# Altium schematic sheet main.SchDoc
size A4; SheetNumber: 1; SheetTotal: 8
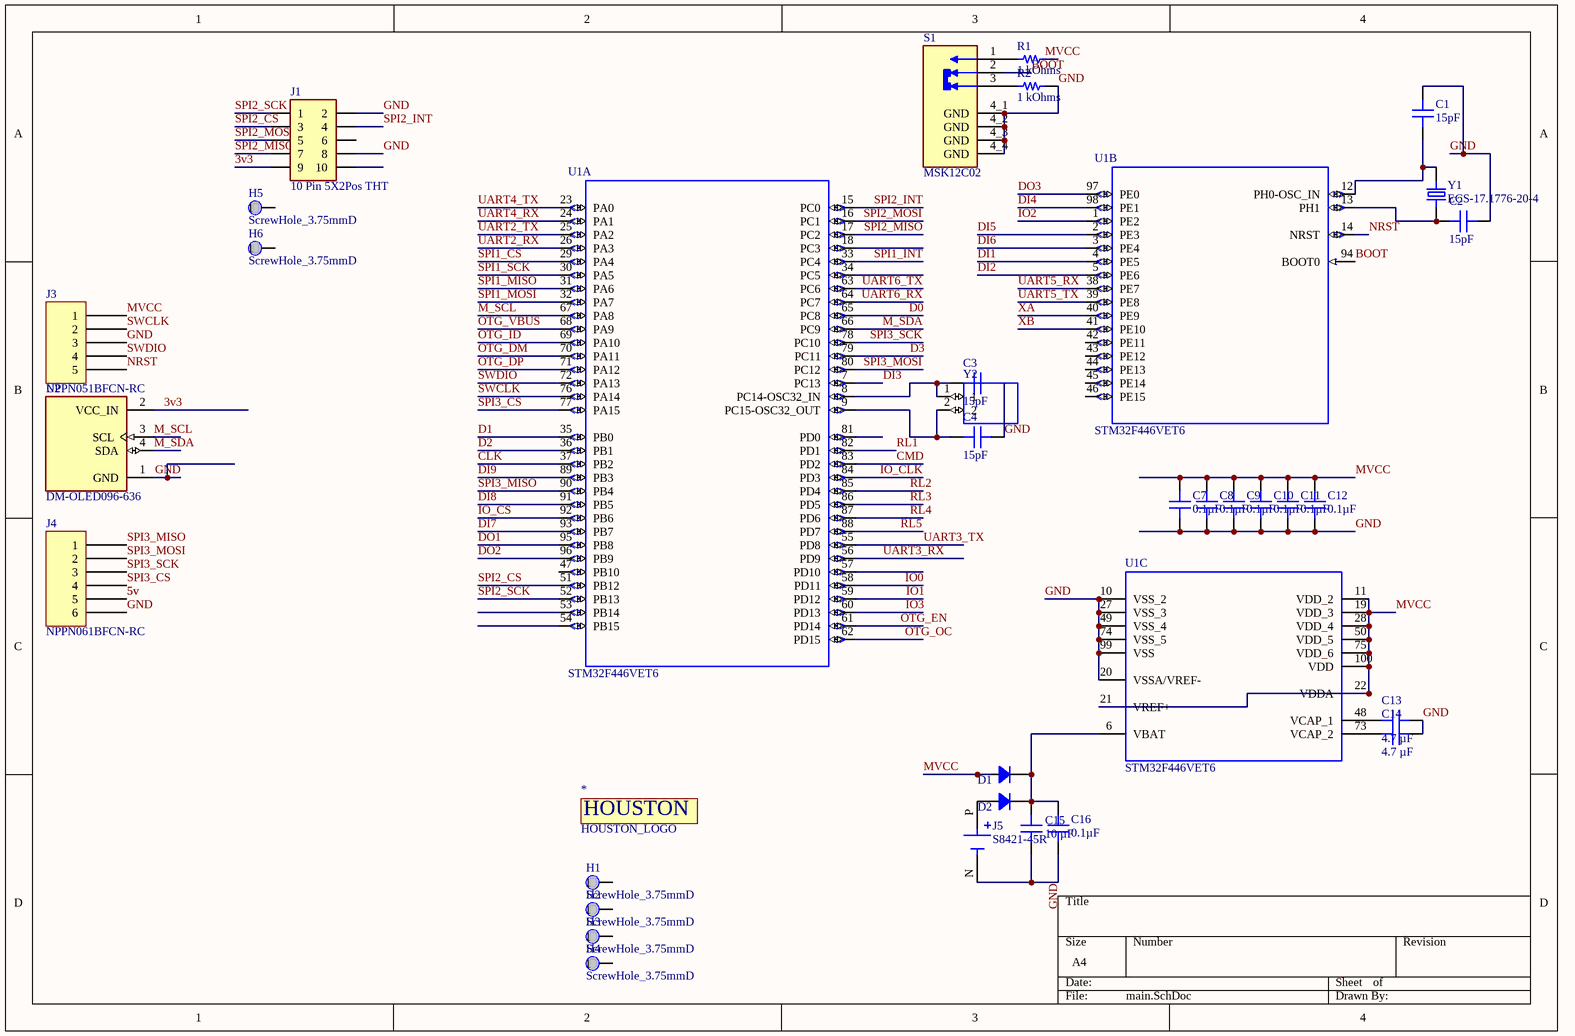
[diagram p0: main.SchDoc]

## Parts
*  HOUSTON_LOGO  [HOUSTON_LOGO]
C1  15pF  [CAP 0805_2012]
C2  15pF  [CAP 0805_2012]
C3  15pF  [CAP 0805_2012]
C4  15pF  [CAP 0805_2012]
C7  Capacitance: 0.1µF  [CAP 0805_2012]  (hidden comment: 1µF)
C8  Capacitance: 0.1µF  [CAP 0805_2012]  (hidden comment: 1µF)
C9  Capacitance: 0.1µF  [CAP 0805_2012]  (hidden comment: 1µF)
C10  Capacitance: 0.1µF  [CAP 0805_2012]  (hidden comment: 1µF)
C11  Capacitance: 0.1µF  [CAP 0805_2012]  (hidden comment: 1µF)
C12  Capacitance: 0.1µF  [CAP 0805_2012]  (hidden comment: 1µF)
C13  4.7 µF  [CAP 0805_2012]
C14  4.7 µF  [CAP 0805_2012]
C15  10 µF  [CAP 1206_3216 - 0.8MM]
C16  Capacitance: 0.1µF  [CAP 0805_2012]  (hidden comment: 1µF)
D1  CGRA4007-G  [DO214AC SMA]  (value not drawn)
D2  CGRA4007-G  [DO214AC SMA]  (value not drawn)
H1  ScrewHole_3.75mmD  [ScrewHole_3.75mmD - duplicate]
H2  ScrewHole_3.75mmD  [ScrewHole_3.75mmD - duplicate]
H3  ScrewHole_3.75mmD  [ScrewHole_3.75mmD - duplicate]
H4  ScrewHole_3.75mmD  [ScrewHole_3.75mmD - duplicate]
H5  ScrewHole_3.75mmD  [ScrewHole_3.75mmD - duplicate]
H6  ScrewHole_3.75mmD  [ScrewHole_3.75mmD - duplicate]
J1  10 Pin 5X2Pos THT  [10 Pin 5X2Pos THT]
J3  NPPN051BFCN-RC  [SULLINS NPPN051BFCN]
J4  NPPN061BFCN-RC  [SULLINS NPPN061BFCN]
J5  S8421-45R  [HARWIN_S8421-45R]
R1  1 kOhms  [RES 0805_2012]
R2  1 kOhms  [RES 0805_2012]
S1  MSK12C02  [SW_MSK12C02]
U1  STM32F446VET6  [LQFP100-14X14MM]  (parts A,B,C of 3)
U2  DM-OLED096-636  [MODULE_DM-OLED096-636]
Y1  ECS-17.1776-20-4  [XTAL_ECS-160-20-4X]
Y2  CFS-20632768EZBB  [CFS20632768EZBB]  (value not drawn)

## Nets
3v3: J1.9 U2.2(VCC_IN)
5v: J4.5
BOOT: S1.2 U1.94(BOOT0)
CLK: U1.37(PB2)
CMD: U1.83(PD2)
D0: U1.65(PC8)
D1: U1.35(PB0)
D2: U1.36(PB1)
D3: U1.79(PC11)
DI1: U1.4(PE5)
DI2: U1.5(PE6)
DI3: U1.7(PC13)
DI4: U1.98(PE1)
DI5: U1.2(PE3)
DI6: U1.3(PE4)
DI7: U1.93(PB7)
DI8: U1.91(PB5)
DI9: U1.89(PB3)
DO1: U1.95(PB8)
DO2: U1.96(PB9)
DO3: U1.97(PE0)
GND: C1.2 C2.2 C3.2 C4.2 C7.1 C8.1 C9.1 C10.1 C11.1 C12.1 C13.2 C14.2 C15.1 C16.1 J1.2 J1.8 J3.3 J4.6 J5.N(NEG) R2.2 S1.4_1(GND) S1.4_2(GND) S1.4_3(GND) S1.4_4(GND) U1.10(VSS_2) U1.20(VSSA/VREF-) U1.27(VSS_3) U1.49(VSS_4) U1.74(VSS_5) U1.99(VSS) U2.1(GND)
IO0: U1.58(PD11)
IO1: U1.59(PD12)
IO2: U1.1(PE2)
IO3: U1.60(PD13)
IO_CLK: U1.84(PD3)
IO_CS: U1.92(PB6)
M_SCL: U1.67(PA8) U2.3(SCL)
M_SDA: U1.66(PC9) U2.4(SDA)
MVCC: C7.2 C8.2 C9.2 C10.2 C11.2 C12.2 D1.1 J3.1 R1.1 U1.11(VDD_2) U1.19(VDD_3) U1.21(VREF+) U1.22(VDDA) U1.28(VDD_4) U1.50(VDD_5) U1.75(VDD_6) U1.100(VDD)
NRST: J3.5 U1.14(NRST)
OTG_DM: U1.70(PA11)
OTG_DP: U1.71(PA12)
OTG_EN: U1.61(PD14)
OTG_ID: U1.69(PA10)
OTG_OC: U1.62(PD15)
OTG_VBUS: U1.68(PA9)
RL1: U1.82(PD1)
RL2: U1.85(PD4)
RL3: U1.86(PD5)
RL4: U1.87(PD6)
RL5: U1.88(PD7)
SPI1_CS: U1.29(PA4)
SPI1_INT: U1.33(PC4)
SPI1_MISO: U1.31(PA6)
SPI1_MOSI: U1.32(PA7)
SPI1_SCK: U1.30(PA5)
SPI2_CS: J1.3 U1.51(PB12)
SPI2_INT: J1.4 U1.15(PC0)
SPI2_MISO: J1.7 U1.17(PC2)
SPI2_MOSI: J1.5 U1.16(PC1)
SPI2_SCK: J1.1 U1.52(PB13)
SPI3_CS: J4.4 U1.77(PA15)
SPI3_MISO: J4.1 U1.90(PB4)
SPI3_MOSI: J4.2 U1.80(PC12)
SPI3_SCK: J4.3 U1.78(PC10)
SWCLK: J3.2 U1.76(PA14)
SWDIO: J3.4 U1.72(PA13)
UART2_RX: U1.26(PA3)
UART2_TX: U1.25(PA2)
UART3_RX: U1.56(PD9)
UART3_TX: U1.55(PD8)
UART4_RX: U1.24(PA1)
UART4_TX: U1.23(PA0)
UART5_RX: U1.38(PE7)
UART5_TX: U1.39(PE8)
UART6_RX: U1.64(PC7)
UART6_TX: U1.63(PC6)
XA: U1.40(PE9)
XB: U1.41(PE10)
NetC1_1: C1.1 U1.12(PH0-OSC_IN) Y1.2
NetC2_1: C2.1 U1.13(PH1) Y1.1
NetC3_1: C3.1 U1.8(PC14-OSC32_IN) Y2.1
NetC4_1: C4.1 U1.9(PC15-OSC32_OUT) Y2.2
NetC13_1: C13.1 U1.48(VCAP_1)
NetC14_1: C14.1 U1.73(VCAP_2)
NetC15_2: C15.2 C16.2 D1.2 D2.2 U1.6(VBAT)
NetD2_1: D2.1 J5.P(POS)
NetR1_2: R1.2 S1.1
NetR2_1: R2.1 S1.3

Not connected (* = marked no-connect by the designer): H1 1; H2 1; H3 1; H4 1; H5 1; H6 1; J1 6 10; U1 18(PC3) 34(PC5) 42(PE11) 43(PE12) 44(PE13) 45(PE14) 46(PE15) 47(PB10) 53(PB14) 54(PB15) 57(PD10) 81(PD0)

## Notes on the sheet
- (in symbol HOUSTON_LOGO) HOUSTON

## Library data of the parts
C1-C4 = 08055A150JAT2A: CAP CER 15PF 50V C0G/NP0 0805; manufacturer: AVX Corporation; Temperature Coefficient: C0G, NP0; Tolerance: ±5%; Part Number: 08055A150JAT2A; Capacitance: 15pF; Applications: General Purpose; componentlink1description: Datasheet; componentlink1url: http://datasheets.avx.com/C0GNP0-Dielectric.pdf; componentlink2description: DigiKey Link; componentlink2url: http://digikey.com/product-detail/en/avx-corporation/08055A150JAT2A/478-1306-1-ND/564338; Device Package: 0805 (2012 Metric); lastupdated: 02-09-2020 1.04.40 AM; Lifecycle Status: Active; Minimum Order: 1; Mounting Type: Surface Mount, MLCC; Operating Temperature: -55°C ~ 125°C; Package / Case: 0805 (2012 Metric); packaging: TapeAndReel; partid: 3213; Part Status: Active; price: 0.02; series: -; Size / Dimension: 0.079" L x 0.049" W (2.01mm x 1.25mm); Supplier 1: DigiKey; Supplier Part Number 1: 478-1306-1-ND; Thickness (Max): 0.037" (0.94mm); value: 15pF; Voltage - Rated: 50V
C7-C12 C16 = 0805ZC105KAT4A: CAP CER 1UF 10V X7R 0805; manufacturer: AVX Corporation; Tolerance: ±10%; Part Number: 0805ZC105KAT4A; Applications: General Purpose; componentlink1description: Datasheet; componentlink1url: http://datasheets.avx.com/X7RDielectric.pdf; componentlink2description: DigiKey Link; componentlink2url: http://digikey.com/product-detail/en/avx-corporation/0805ZC105KAT4A/478-7604-1-ND/7536237; Device Package: 0805 (2012 Metric); lastupdated: 02-09-2020 1.04.40 AM; Lifecycle Status: Active; Minimum Order: 1; Mounting Type: Surface Mount, MLCC; Operating Temperature: -55°C ~ 125°C; Package / Case: 0805 (2012 Metric); packaging: TapeAndReel; partid: 3500; Part Status: Active; price: 0.17; series: -; Size / Dimension: 0.079" L x 0.049" W (2.00mm x 1.25mm); Supplier 1: DigiKey; Supplier Part Number 1: 478-7604-1-ND; Temperature Coefficient: X7R; Thickness (Max): 0.037" (0.94mm); value: 1µF; Voltage - Rated: 10V
C13 C14 = C0805X475M3RAC7800: 4.70UF 25.0V; manufacturer: KEMET; Temperature Coefficient: X7R; Tolerance: ±20%; Voltage - Rated: 25V; Part Number: C0805X475M3RAC7800; Capacitance: 4.7 µF; Applications: Boardflex Sensitive; componentlink1description: Datasheet; componentlink1url: https://connect.kemet.com:7667/gateway/IntelliData-ComponentDocumentation/1.0/download/datasheet/C0805X475M3RAC7800; componentlink2description: DigiKey Link; componentlink2url: https://www.digikey.com/en/products/detail/kemet/C0805X475M3RAC7800/12082671; Device Package: 0805 (2012 Metric); Features: Soft Termination; lastupdated: 29-03-2026 7.18.51 PM; Lifecycle Status: Active; Minimum Order: 1; Mounting Type: Surface Mount, MLCC; Operating Temperature: -55°C ~ 125°C; Package / Case: 0805 (2012 Metric); packaging: TapeAndReel; partid: 46494; Part Status: Active; price: 0.15; series: SMD Comm X7R Flex; Size / Dimension: 0.079" L x 0.049" W (2.00mm x 1.25mm); Supplier 1: DigiKey; Supplier Part Number 1: 399-C0805X475M3RAC7800CT-ND; Thickness (Max): 0.057" (1.45mm); value: 4.7 µF
C15 = EMK316BJ106MD-T: CAP CER 10UF 16V X5R 1206; manufacturer: Taiyo Yuden; Tolerance: ±20%; Part Number: EMK316BJ106MD-T; Capacitance: 10 µF; Applications: SMPS Filtering; componentlink1description: Datasheet; componentlink1url: http://www.yuden.co.jp/productdata/catalog/mlcc06_e.pdf; componentlink2description: DigiKey Link; componentlink2url: https://www.digikey.com/en/products/detail/taiyo-yuden/EMK316BJ106MD-T/6563474; Device Package: 1206 (3216 Metric); lastupdated: 04-06-2024 7.10.41 PM; Lifecycle Status: Active; Minimum Order: 1; Mounting Type: Surface Mount, MLCC; Operating Temperature: -55°C ~ 85°C; Package / Case: 1206 (3216 Metric); packaging: TapeAndReel; partid: 18996; Part Status: Active; price: 0.04; series: M; Size / Dimension: 0.126" L x 0.063" W (3.20mm x 1.60mm); Supplier 1: DigiKey; Supplier Part Number 1: 587-4881-1-ND; Temperature Coefficient: X5R; Thickness (Max): 0.037" (0.95mm); value: 10 µF; Voltage - Rated: 16V
D1 D2 = CGRA4007-G: DIODE GEN PURP 1KV 1A DO214AC; Manufacturer: Comchip Technology; Current - Reverse Leakage @ Vr: 5 µA @ 1000 V; Diode Type: Standard; Speed: Standard Recovery >500ns, > 200mA (Io); Voltage - DC Reverse (Vr) (Max): 1000 V; Voltage - Forward (Vf) (Max) @ If: 1.1 V @ 1 A; Part Number: CGRA4007-G; ComponentLink1Description: Datasheet; ComponentLink1URL: http://www.comchiptech.com/admin/files/product/CGRA4001-G Thru647907. CGRA4007-G RevE.pdf; ComponentLink2Description: DigiKey Link; ComponentLink2URL: https://www.digikey.com/en/products/detail/comchip-technology/CGRA4007-G/1121050; Current - Average Rectified (Io): 1A; LastUpdated: 03-06-2024 7.54.36 PM; Lifecycle Status: Active; Minimum Order: 1; Mounting Type: Surface Mount; Operating Temperature - Junction: -55°C ~ 150°C; Package / Case: DO-214AC, SMA; Packaging: TapeAndReel; PartId: 670; Part Status: Active; Price: 0.04; Series: -; Supplier 1: DigiKey; Supplier Part Number 1: 641-1018-1-ND; Supplier Device Package: DO-214AC (SMA)
H1-H6 = ScrewHole_3.75mmD: SCREW HEAD DIA 4.5MM, SREW LEG DIA 3 MM
J1 = 10 Pin 5X2Pos THT: 10 Pin 5X2Pos THT BergeStick 2.54MM MTSW-105-X-X-D-X; MF: {'manufacturer': u'Samtec Inc.'}; Package: None; Price: None; Value: *; MP: MTSW-105-X-X-D-X; Availability: Unavailable
J3 = NPPN051BFCN-RC: CONN HDR 5POS 0.079 GOLD PCB; Manufacturer: Sullins Connector Solutions; Connector Type: Header; Contact Length - Post: 0.094" (2.40mm); Current Rating (Amps): 2A; Material Flammability Rating: UL94 V-0; Number of Positions: 5; Number of Positions Loaded: All; Pitch - Mating: 0.079" (2.00mm); Style: Board to Board; Part Number: NPPN051BFCN-RC; ComponentLink1Description: Datasheet; ComponentLink1URL: https://drawings-pdf.s3.amazonaws.com/10483.pdf; ComponentLink2Description: DigiKey Link; ComponentLink2URL: https://www.digikey.com/en/products/detail/sullins-connector-solutions/NPPN051BFCN-RC/804807; Contact Finish - Mating: Gold; Contact Finish - Post: Gold; Contact Finish Thickness - Mating: Flash; Contact Type: Female Socket; Fastening Type: Push-Pull; Insulation Color: Black; Insulation Height: 0.173" (4.40mm); LastUpdated: 21-06-2022 2.43.08 PM; Lifecycle Status: Active; Minimum Order: 1; Mounting Type: Through Hole; Number of Rows: 1; Operating Temperature: -40°C ~ 105°C; Packaging: Tube; Part Status: Active; Price: 0.35; Series: -; Supplier 1: DigiKey; Supplier Part Number 1: S5751-05-ND; Termination: Solder
J4 = NPPN061BFCN-RC: CONN HDR 6POS 0.079 GOLD PCB; Manufacturer: Sullins Connector Solutions; Connector Type: Header; Contact Length - Post: 0.094" (2.40mm); Current Rating (Amps): 2A; Material Flammability Rating: UL94 V-0; Number of Positions: 6; Number of Positions Loaded: All; Pitch - Mating: 0.079" (2.00mm); Style: Board to Board; Part Number: NPPN061BFCN-RC; ComponentLink1Description: Datasheet; ComponentLink1URL: https://drawings-pdf.s3.amazonaws.com/10483.pdf; ComponentLink2Description: DigiKey Link; ComponentLink2URL: https://www.digikey.com/en/products/detail/sullins-connector-solutions/NPPN061BFCN-RC/804808; Contact Finish - Mating: Gold; Contact Finish - Post: Gold; Contact Finish Thickness - Mating: Flash; Contact Type: Female Socket; Fastening Type: Push-Pull; Insulation Color: Black; Insulation Height: 0.173" (4.40mm); LastUpdated: 21-06-2022 2.43.22 PM; Lifecycle Status: Active; Minimum Order: 1; Mounting Type: Through Hole; Number of Rows: 1; Operating Temperature: -40°C ~ 105°C; Packaging: Tube; Part Status: Active; Price: 0.40; Series: -; Supplier 1: DigiKey; Supplier Part Number 1: S5751-06-ND; Termination: Solder
J5 = S8421-45R: Coin Cell Battery Retainer, Horizontal SMT, for CR2032 Coin Cell Batteries, Tape & Reeled; MF: Harwin; SnapEDA_Link: https://www.snapeda.com/parts/S8421-45R/Harwin+Inc./view-part/?ref=snap; Package: None; Value: *; MP: S8421-45R; Check_prices: https://www.snapeda.com/parts/S8421-45R/Harwin+Inc./view-part/?ref=eda
R1 R2 = ESR10EZPF1001: RES SMD 1K OHM 1% 0.4W 0805; Manufacturer: Rohm Semiconductor; Power (Watts): 0.4W, 2/5W; Temperature Coefficient: ±100ppm/°C; Part Number: ESR10EZPF1001; Value: 1 kOhms; ComponentLink1Description: Datasheet; ComponentLink1URL: https://www.rohm.com/datasheet/ESR01MZPF/esr-e; ComponentLink2Description: DigiKey Link; ComponentLink2URL: https://www.digikey.com/en/products/detail/rohm-semiconductor/ESR10EZPF1001/1983480; Composition: Thick Film; Device Package: 0805 (2012 Metric); Features: Automotive AEC-Q200, Pulse Withstanding; Height - Seated (Max): 0.026" (0.65mm); LastUpdated: 08-02-2024 9.02.37 PM; Lifecycle Status: Active; Minimum Order: 1; Number of Terminations: 2; Operating Temperature: -55°C ~ 155°C; Package / Case: 0805 (2012 Metric); Packaging: TapeAndReel; PartId: 28032; Part Status: Active; Price: 0.02; Ratings: AEC-Q200; Resistance: 1 kOhms; Series: ESR; Size / Dimension: 0.079" L x 0.049" W (2.00mm x 1.25mm); Supplier 1: DigiKey; Supplier Part Number 1: RHM1.00KAECT-ND; Supplier Device Package: 0805; Tolerance: ±1%
U1 = STM32F446VET6: ARMÂ® CortexÂ®-M4 STM32F4 Microcontroller IC 32-Bit Single-Core 180MHz 512KB (512K x 8) FLASH 100-LQFP (14x14); MF: STMicroelectronics; SnapEDA_Link: https://www.snapeda.com/parts/STM32F446VET6/STMicroelectronics/view-part/?ref=snap; Package: LQFP-100 STMicroelectronics; Value: *; MP: STM32F446VET6; Check_prices: https://www.snapeda.com/parts/STM32F446VET6/STMicroelectronics/view-part/?ref=eda
U2 = DM-OLED096-636: 0.96â€ 128 X 64 MONOCHROME GRAPHIC OLED DISPLAY MODULE - I2C; SnapEDA_Link: https://www.snapeda.com/parts/DM-OLED096-636/Display+Module/view-part/?ref=snap; Package: Package; Value: *; MF: Display Module; MP: DM-OLED096-636; Check_prices: https://www.snapeda.com/parts/DM-OLED096-636/Display+Module/view-part/?ref=eda
Y1 = ECS-17.1776-20-4: Crystals 17.1776MHz HC49S; MF: ECS International; SnapEDA_Link: https://www.snapeda.com/parts/ECS-17.1776-20-4/ECS/view-part/?ref=snap; Package: HC-49US ECS Inc.; Value: *; MP: ECS-17.1776-20-4; Check_prices: https://www.snapeda.com/parts/ECS-17.1776-20-4/ECS/view-part/?ref=eda
Y2 = CFS-20632768EZBB: 32.768kHz Â±10ppm Crystal 6pF 35 kOhms Cylindrical Can, Radial; MF: Citizen Finedevice; SnapEDA_Link: https://www.snapeda.com/parts/CFS-20632768EZBB/Citizen%20Finedevice%20Co%20Ltd/view-part/2815870/?ref=snap; Availability: Warning; Package: Cylindrical Can Radial  Citizen Finetech Miyota; Price: None; MP: CFS-20632768EZBB; Value: *; Purchase-URL: https://pricing.snapeda.com/search/part/CFS-20632768EZBB/?ref=eda; Check_prices: https://www.snapeda.com/parts/CFS-20632768EZBB/Citizen%20Finedevice%20Co%20Ltd/view-part/2815870/?ref=eda
S1 = MSK12C02: Package: None; Price: None; Value: *; MP: MSK12C02; Availability: Unavailable